# Altium schematic sheet 12V to5v_5V to 3.3V.SchDoc
size A; SheetNumber: 3; SheetTotal: 3
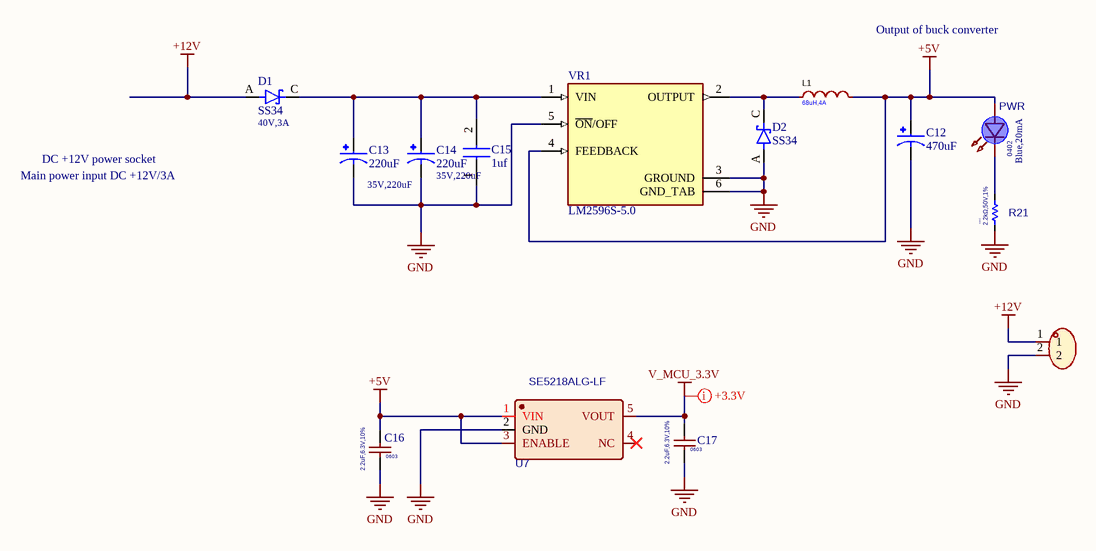
[diagram p0: 12V to5v_5V to 3.3V.SchDoc]

## Parts
C12  470uF  [Plugin,6.3x8mm]
C13  220uF  value 35V,220uF  [Plugin,6.3x8mm]
C14  220uF  value 35V,220uF  [Plugin,6.3x8mm]
C15  1uf  [C0805]
C16  Package: 0603  [C0603]  (hidden comment: 2.2uF,6.3V,10%)
C17  Package: 0603  [C0603]  (hidden comment: 2.2uF,6.3V,10%)
D1  SS34  value 40V,3A  [SMA]
D2  SS34  [SMA]
L1  value 68uH,4A  [ind_SMD_12.3x12.3mm]  (hidden comment: 68uH)
PWR  value Blue,20mA  Package: 0402  [LED 0402]  (hidden comment: XL-1005UBC)
R21  value 2.2kΩ,50V,1%  Package: 0402  [R0402]  (hidden comment: 2.2KΩ)
U5  DB128L-5.08-2P-GN-S  [2P_P=5.08mm]  (value not drawn)
U7  SE5218ALG-LF  [SOT-23-5]
VR1  LM2596S-5.0  [TO-263-5]

## Nets
+5V: C12.1 C16.1 L1.2 PWR.2(A) U7.1(VIN) U7.3(ENABLE) VR1.4(FEEDBACK)
+12V: D1.A U5.1
GND: C12.2 C13.2 C14.2 C15.1(C1) C16.2 C17.2 D2.A R21.1 U5.2 U7.2(GND) VR1.3(GROUND) VR1.5(~{ON}/OFF) VR1.6(GND_TAB)
V_MCU_3.3V: C17.1 U7.5(VOUT)
NetC13_1: C13.1 C14.1 C15.2(C2) D1.C(K) VR1.1(VIN)
NetD2_C: D2.C(K) L1.1 VR1.2(OUTPUT)
NetPWR_1: PWR.1(K) R21.2

Not connected (* = marked no-connect by the designer): U7 4(NC)*

## Layout directives
net class +3.3V: V_MCU_3.3V

## Notes on the sheet
- Output of buck converter
- Main power input DC +12V/3A
- DC +12V power socket

## Library data of the parts
C12 = SPTOJM471E08OR: 6.3V 470uF ±20% Plugin,6.3x8mm Solid Capacitors ROHS; MPN: EEE-HC1H101P; Manufacturer: Panasonic; Package Reference: RADIAL-2 Panasonic; Value: *
C13 C14 = NPXC1101V221MJTM: 220uF 35V ±20% Plugin,D6.3xL11mm Aluminum Electrolytic Capacitors - Leaded ROHS; Manufacturer: Ymin; Package: Plugin,D6.3xL11mm; MPN: NPXC1101V221MJTM; Datasheet: https://www.lcsc.com/datasheet/lcsc_datasheet_2205250916_Ymin-NPXC1101V221MJTM_C2976311.pdf; LCSC: C2976311
C15 = CL21B105KBFNNNE: 50V 1uF X7R ±10% 0805 Multilayer Ceramic Capacitors MLCC - SMD/SMT ROHS; Manufacturer: KEMET; MPN: CC0603JRNPO9BN180
C16 C17 = CGA3E1X7R0J225K080AC: CAP CER 2.2UF 6.3V X7R 0603; Manufacturer: TDK Corporation; Type: SM; Min Operating Temp: -55°C; Max Operating Temp: 125°C; MPN: CGA3E1X7R0J225K080AC; Datasheet: https://product.tdk.com/system/files/dam/doc/product/capacitor/ceramic/mlcc/catalog/mlcc_automotive_general_en.pdf; Value: 2.2uF,6.3V,10%
D1 D2 = SS34: Diode Schottky 40V 3A 2-Pin SMC T/R; MPN: SS34
  D1: Package: None
  D2: Value: *; Package Reference: None
L1 = SMDRI127-680MT: 2.1A 68uH Shielded inductor ±20% 4A SMD,12.3x12.3mm Power Inductors ROHS; Manufacturer: SXN(顺翔诺); LCSC: C9907; MPN: SMDRI127-680MT; Package: SMD,12.3x12.3mm; Datasheet: https://atta.szlcsc.com/upload/public/pdf/source/20210810/6F96FDC19AA308DD2AD166FFB9640E87.pdf
PWR = XL-1005UBC: 20mA 240mcd Colorless Transparent Lens -20℃~+85℃ 455nm~475nm Positive Stick Blue 120° 70mW 3.3V 0402 LED Indication - Discrete ROHS; Manufacturer: XINGLIGHT; Datasheet: https://www.lcsc.com/datasheet/lcsc_datasheet_2409271833_XINGLIGHT-XL-1005UBC_C22355736.pdf; LCSC: C22355736; MPN: XL-1005UBC
R21 = RC0402FR-072K2L: 62.5mW Thick Film Resistors 50V ±100ppm/℃ ±1% 2.2kΩ 0402 Chip Resistor - Surface Mount ROHS; Manufacturer: YAGEO; Max Operating Temp: +155; MPN: RC0402FR-072K2L; Datasheet: https://datasheet.lcsc.com/lcsc/2304140030_YAGEO-RC0402FR-072K2L_C114762.pdf; Min Operating Temp: -55; LCSC: C114762
U5 = DB128L-5.08-2P-GN-S: 1x2P 18A -40℃~+105℃ 250V Green 12~30 Direct Insert 5.08mm 2.5 1 2 Plugin,P=5.08mm Screw Terminal; Manufacturer: DORABO; Lcsc: C395868; MPN: DB128L-5.08-2P-GN-S; Package: 插件,P=5.08mm; Datasheet: https://atta.szlcsc.com/upload/public/pdf/source/20230106/B067FE0E641A396A370D47F93C345689.pdf; Operating Temperature Range: -40℃~+105℃
U7 = SE5218ALG-LF: 75dB 500mA Adjustable 3.3V Positive electrode 5V SOT-23-5 Voltage Regulators - Linear, Low Drop Out (LDO) Regulators ROHS; Manufacturer: SEAWARD(思旺); MPN: SE5218ALG-LF; LCSC: C118233; Datasheet: https://www.lcsc.com/datasheet/lcsc_datasheet_2304140030_Seaward-Elec-SE5218ALG-LF_C118233.pdf; Package: SOT-23-5
VR1 = LM2596S-5.0: Step-down type Fixed 40V~40V 5V 3A TO-263-5 DC-DC Converters ROHS; Value: *; Package Reference: None; MPN: LM2596S-5.0